# EAGLE design 303_phonejack (EAGLE 9.6.2)
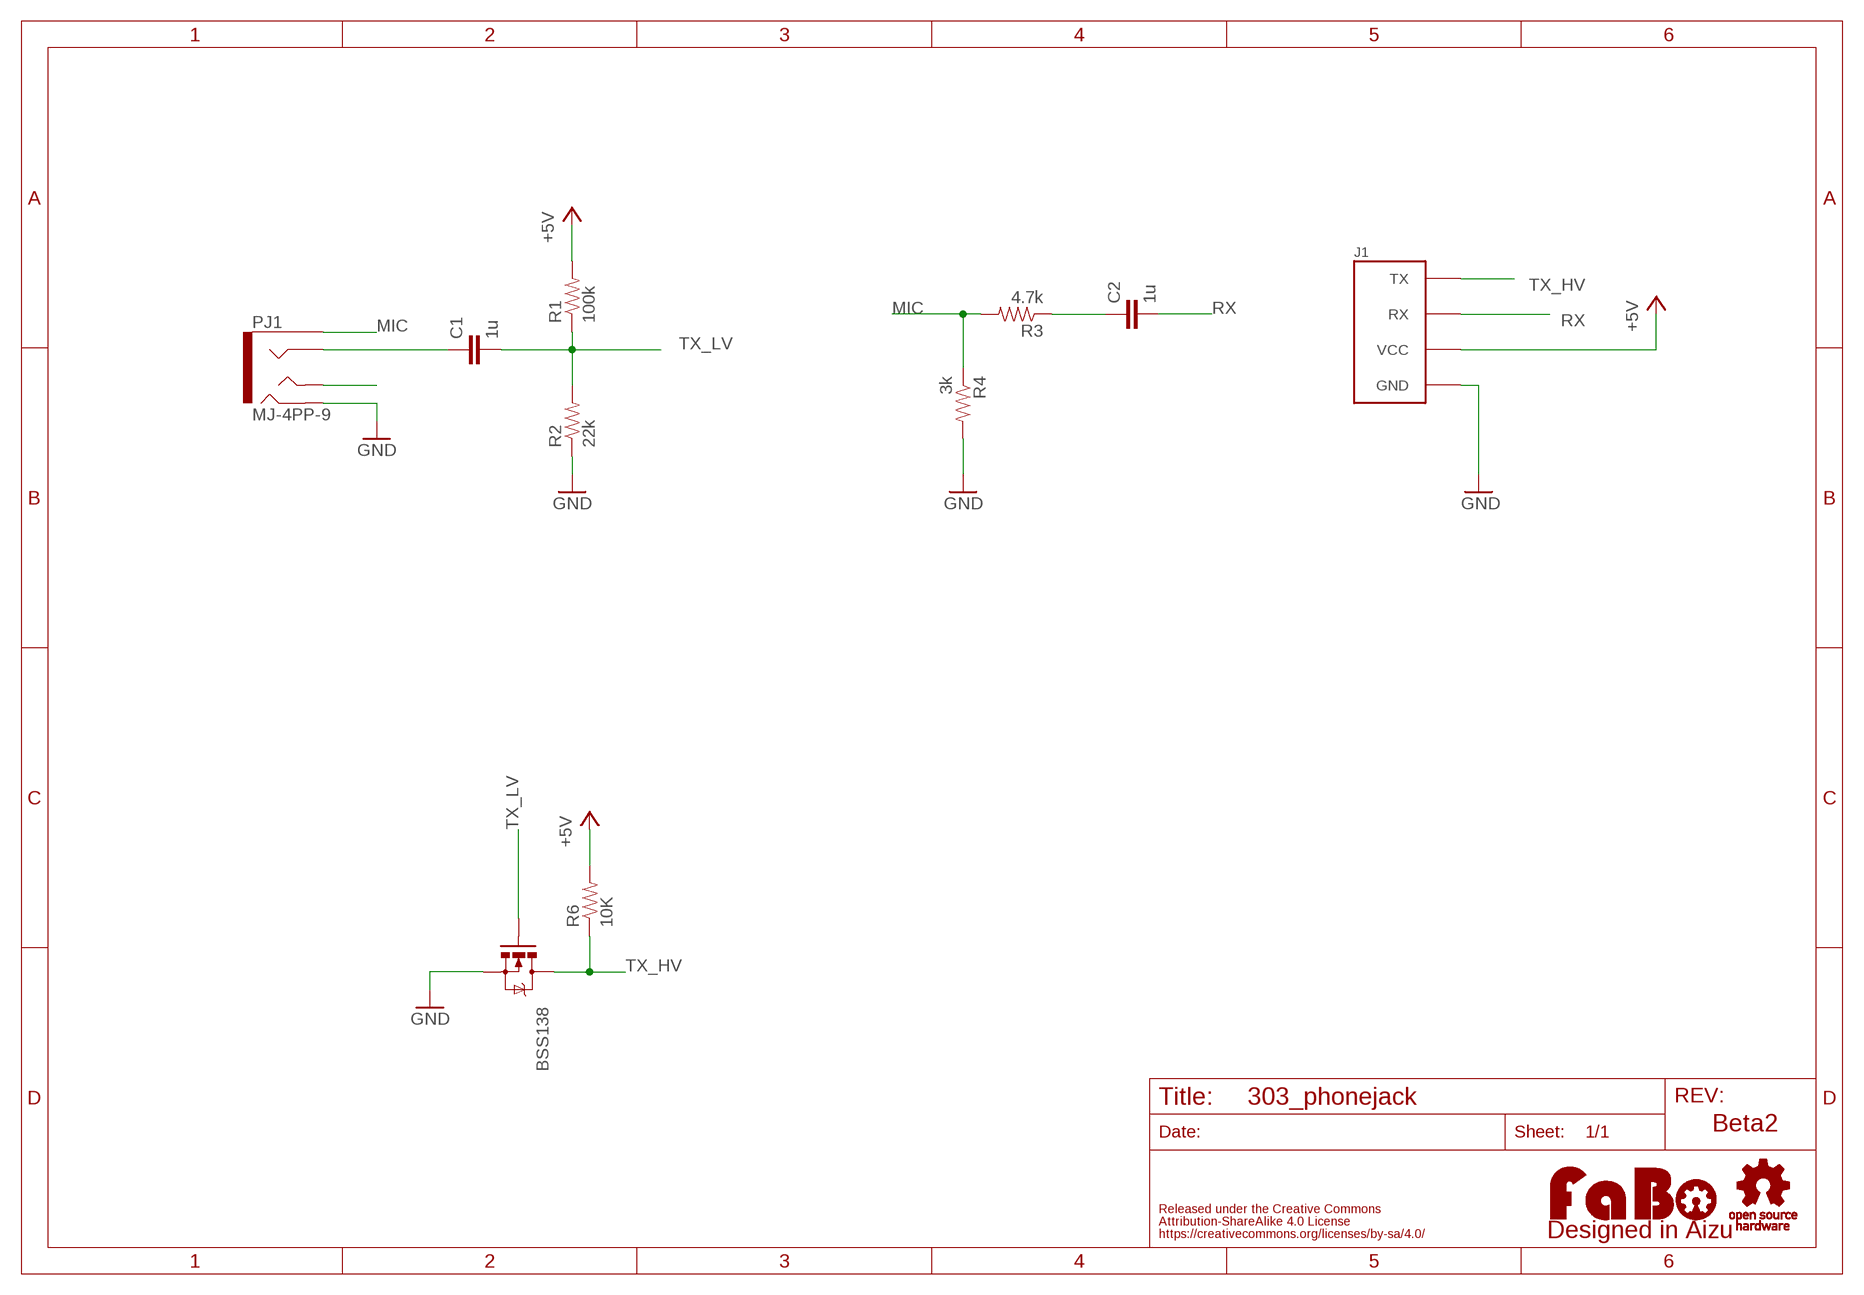
[diagram p0: schematic, sheet 1]

## Parts
BSS138  MOSFET-NCHANNELSMD  [SOT23-3]
C1  1u  CAP-EIA0603  [EIA0603-CAP]
C2  1u  CAP-EIA0603  [EIA0603-CAP]
J1  0  BRICK_SERIAL  [BRICK_SERIAL]
LOGO1  LOGO_FABO-M  [LOGO_FABO_M]
PJ1  MJ-4PP-9  [PHONEJACK-MJ-4PP-9]
R1  100k  RESISTOR0603  [EIA0603-RES]
R2  22k  RESISTOR0603  [EIA0603-RES]
R3  4.7k  RESISTOR0603  [EIA0603-RES]
R4  3k  RESISTOR0603  [EIA0603-RES]
R6  10K  RESISTOR0603-RES  [0603-RES]
U$2  LOGO_OSHW-M_BOTTOM  [LOGO_OSHW_M_BOTTOM]

## Nets
+5V: J1.VCC R1.2 R6.2
GND: BSS138.2(S) J1.GND PJ1.B R2.1 R4.2
MIC: PJ1.A R3.2 R4.1
N$1: C2.1 R3.1
N$2: C1.1 PJ1.C
N$3: PJ1.D
RX: C2.2 J1.RX
TX_HV: BSS138.3(D) J1.TX R6.1
TX_LV: BSS138.1(G) C1.2 R1.1 R2.2

## Notes on the sheet
- Beta2

## Library data of the parts
BSS138 = SparkFun:MOSFET-NCHANNEL
C1 C2 = gclue:CAP: Capacitor Standard 0603 ceramic capacitor
J1 = gclue:BRICK_SERIAL: FaBo Brick 4pin(SERIAL)
LOGO1 = component:LOGO_FABO
PJ1 = gclueParts:MJ-4PP-9: 3.5mm PhoneJack 4 conductor MJ-4PP-9 http://akizukidenshi.com/download/ds/avvicon/MJ-4PP-9.pdf
R1-R4 = gclue:RESISTOR
R6 = SparkFun:RESISTOR: Resistor Basic schematic elements and footprints for 0603, 1206, and PTH resistors.
U$2 = component:LOGO_OSHW

## Net classes
0 default: clearance 0.254 mm

## Board
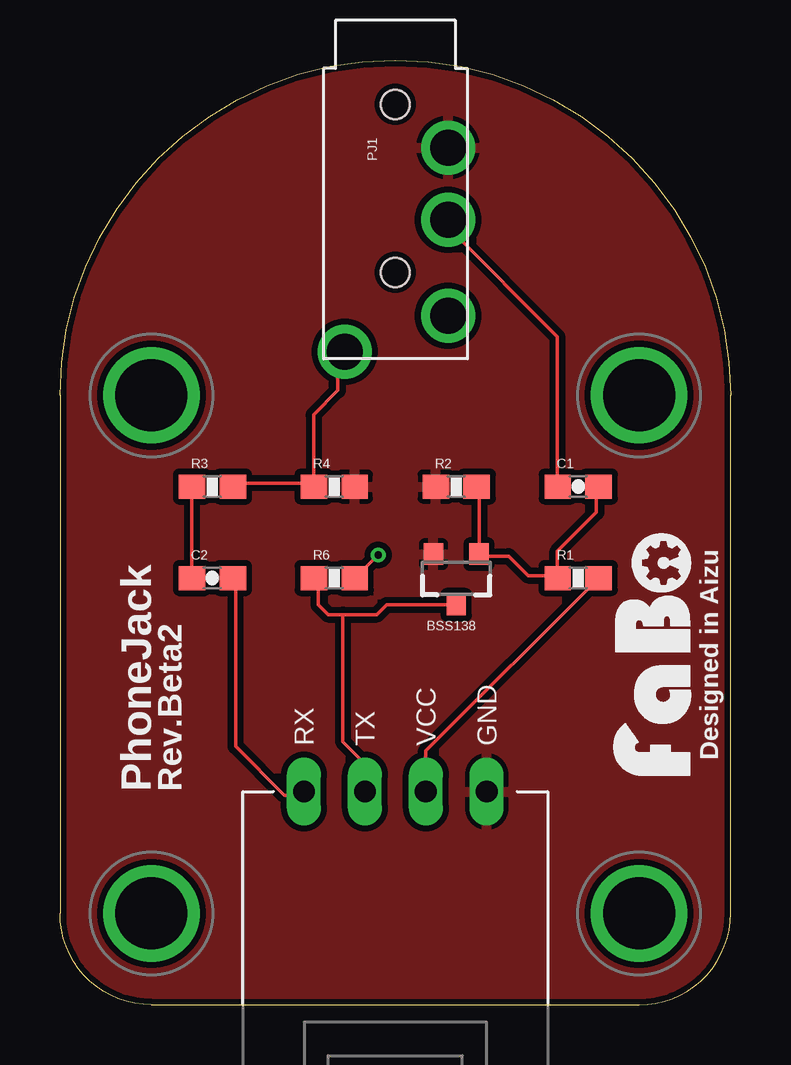
[diagram p1: board, top side]
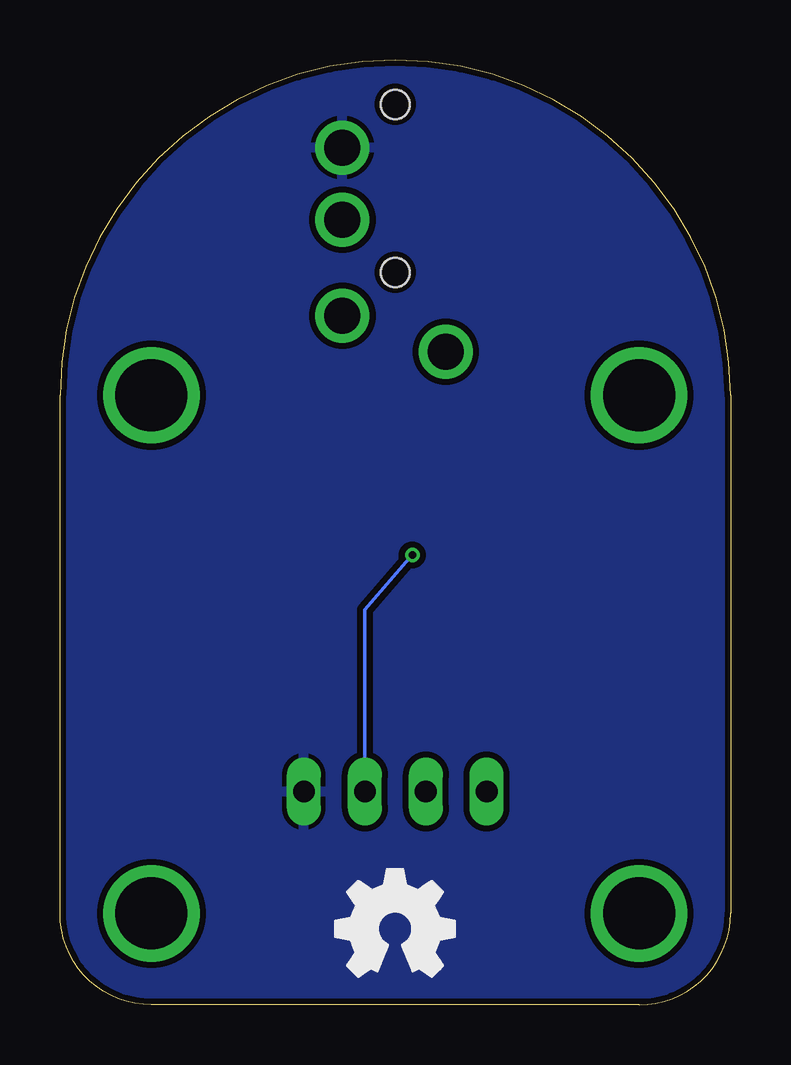
[diagram p2: board, bottom side, seen from below]

Size 27.94 x 39.37 mm. Coordinates in mm from the lower left corner, seen from the top.
Copper layers (1*16): Top 0.035mm / dielectric 1.6mm / Bottom 0.035mm
Design rules "PCBway": minimum track width 6mil, minimum drill 12mil, track to track 6mil, track to pad 6mil, pad to pad 6mil, via to via 6mil, smd to smd 6mil, copper to edge 10mil, drill to drill 10mil, minimum pad ring 10mil, minimum via ring 6mil, stop-mask expansion 2mil, vias tented up to drill 100mil, thermal gap 8mil

### Footprints (pad centres in the part's own frame; a part is rotated, then mirrored left to right if it is on the bottom)
SOT23-3 = smd 0.8 x 0.9: 1 -0.95,-1; 2 0.95,-1; 3 0,1.1
EIA0603-CAP = smd 1.1 x 1: 1 -0.85,0; 2 0.85,0
BRICK_SERIAL = drill 0.9 long: GND 3.81,-10.16; RX -3.81,-10.16; TX -1.27,-10.16; VCC 1.27,-10.16 | drill 3 pad 3.81: P$5 -10.16,6.35; P$6 10.16,6.35; P$7 -10.16,-15.24; P$8 10.16,-15.24
PHONEJACK-MJ-4PP-9 = drill 1.5: A 5.8,-2.1; B -2.7,2.2; C 0.3,2.2; D 4.3,2.2 | hole 1.2: -4.5,0; 2.5,0
EIA0603-RES = smd 1.1 x 1: 1 -0.85,0; 2 0.85,0
0603-RES = smd 1.1 x 1: 1 -0.85,0; 2 0.85,0

### Placement (x,y rotation side)
BSS138  16.51,17.78 180 top
C1  21.59,21.59 0 top
C2  6.35,17.78 0 top
J1  13.97,19.05 0 top
LOGO1  26.67,14.61 90 top
PJ1  13.97,33.02 270 top
R1  21.59,17.78 0 top
R2  16.51,21.59 0 top
R3  6.35,21.59 0 top
R4  11.43,21.59 0 top
R6  11.43,17.78 0 top
U$2  13.97,3.17 0 top

### Tracks (layer width: path | path; a pad name or v marks a point on that pad's centre or on a via)
+5V  (via drill 0.3)
  Top 0.152: J1.VCC 15.24,10.58 R1.2 | R6.2 12.94,18.44 v13.26,18.75
  Bottom 0.152: v13.26,18.75 15.24,16.46 J1.VCC
GND
  pour Bottom: -1.27,-1.27 29.21,-1.27 29.21,40.64 -1.27,40.64
  pour Top: -1.27,-1.27 29.21,-1.27 29.21,40.64 -1.27,40.64
MIC
  Top 0.152: 10.57,21.74 7.32,21.74 R3.2 | 10.57,21.74 10.57,24.59 11.58,25.6 11.58,26.82 11.79,27.03 PJ1.A | 10.57,21.74 R4.1
N$1
  Top 0.152: C2.1 5.49,17.88 5.49,21.54 R3.1
N$2
  Top 0.152: C1.1 20.73,21.74 20.73,27.84 16.26,32.31 16.26,32.72 PJ1.C
RX
  Top 0.152: C2.2 7.32,17.68 7.32,10.77 9.35,8.74 10.16,8.74 J1.RX
TX_HV
  Top 0.152: 11.79,16.26 11.18,16.26 10.77,16.66 10.77,17.68 R6.1 | 11.79,16.26 13.21,16.26 13.61,16.66 16.46,16.66 BSS138.3 | 11.79,16.26 11.79,10.97 12.6,10.16 12.6,8.94 J1.TX
TX_LV
  Top 0.152: R2.2 17.48,21.54 17.48,18.9 BSS138.1 17.48,18.69 18.69,18.69 19.51,17.88 20.73,17.88 | 20.73,17.88 20.73,18.9 22.35,20.52 22.35,21.54 C1.2 | 20.73,17.88 R1.1

### Text on the board
tPlace: Designed in Aizu | PhoneJack | Rev.Beta2